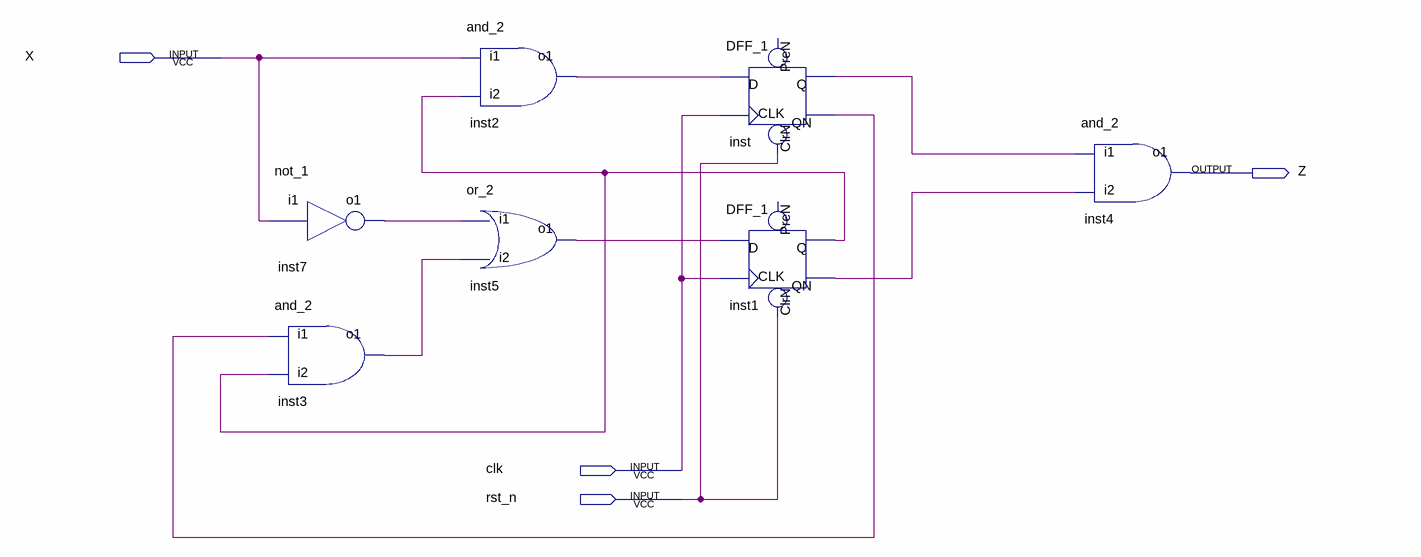
[diagram p0: schematic sheet]
// Quartus schematic SD.bdf as structural Verilog: 7 symbols, 4 pins
module SD (
  input  X,
  input  clk,
  input  rst_n,
  output Z
);

  wire inst1_q, inst1_qn, inst2_o1, inst3_o1, inst5_o1, inst7_o1, inst_q, inst_qn;

  not_1 inst7 (.i1(X), .o1(inst7_o1));
  and_2 inst3 (.i1(inst_qn), .i2(inst1_q), .o1(inst3_o1));
  and_2 inst2 (.i1(X), .i2(inst1_q), .o1(inst2_o1));
  or_2 inst5 (.i1(inst7_o1), .i2(inst3_o1), .o1(inst5_o1));
  DFF_1 inst (.CLK(clk), .D(inst2_o1), .ClrN(rst_n), .QN(inst_qn), .Q(inst_q));  // open: PreN
  DFF_1 inst1 (.CLK(clk), .D(inst5_o1), .ClrN(rst_n), .QN(inst1_qn), .Q(inst1_q));  // open: PreN
  and_2 inst4 (.i1(inst_q), .i2(inst1_qn), .o1(Z));
endmodule
